# EAGLE design hundredsteppers (EAGLE 6.6.0)
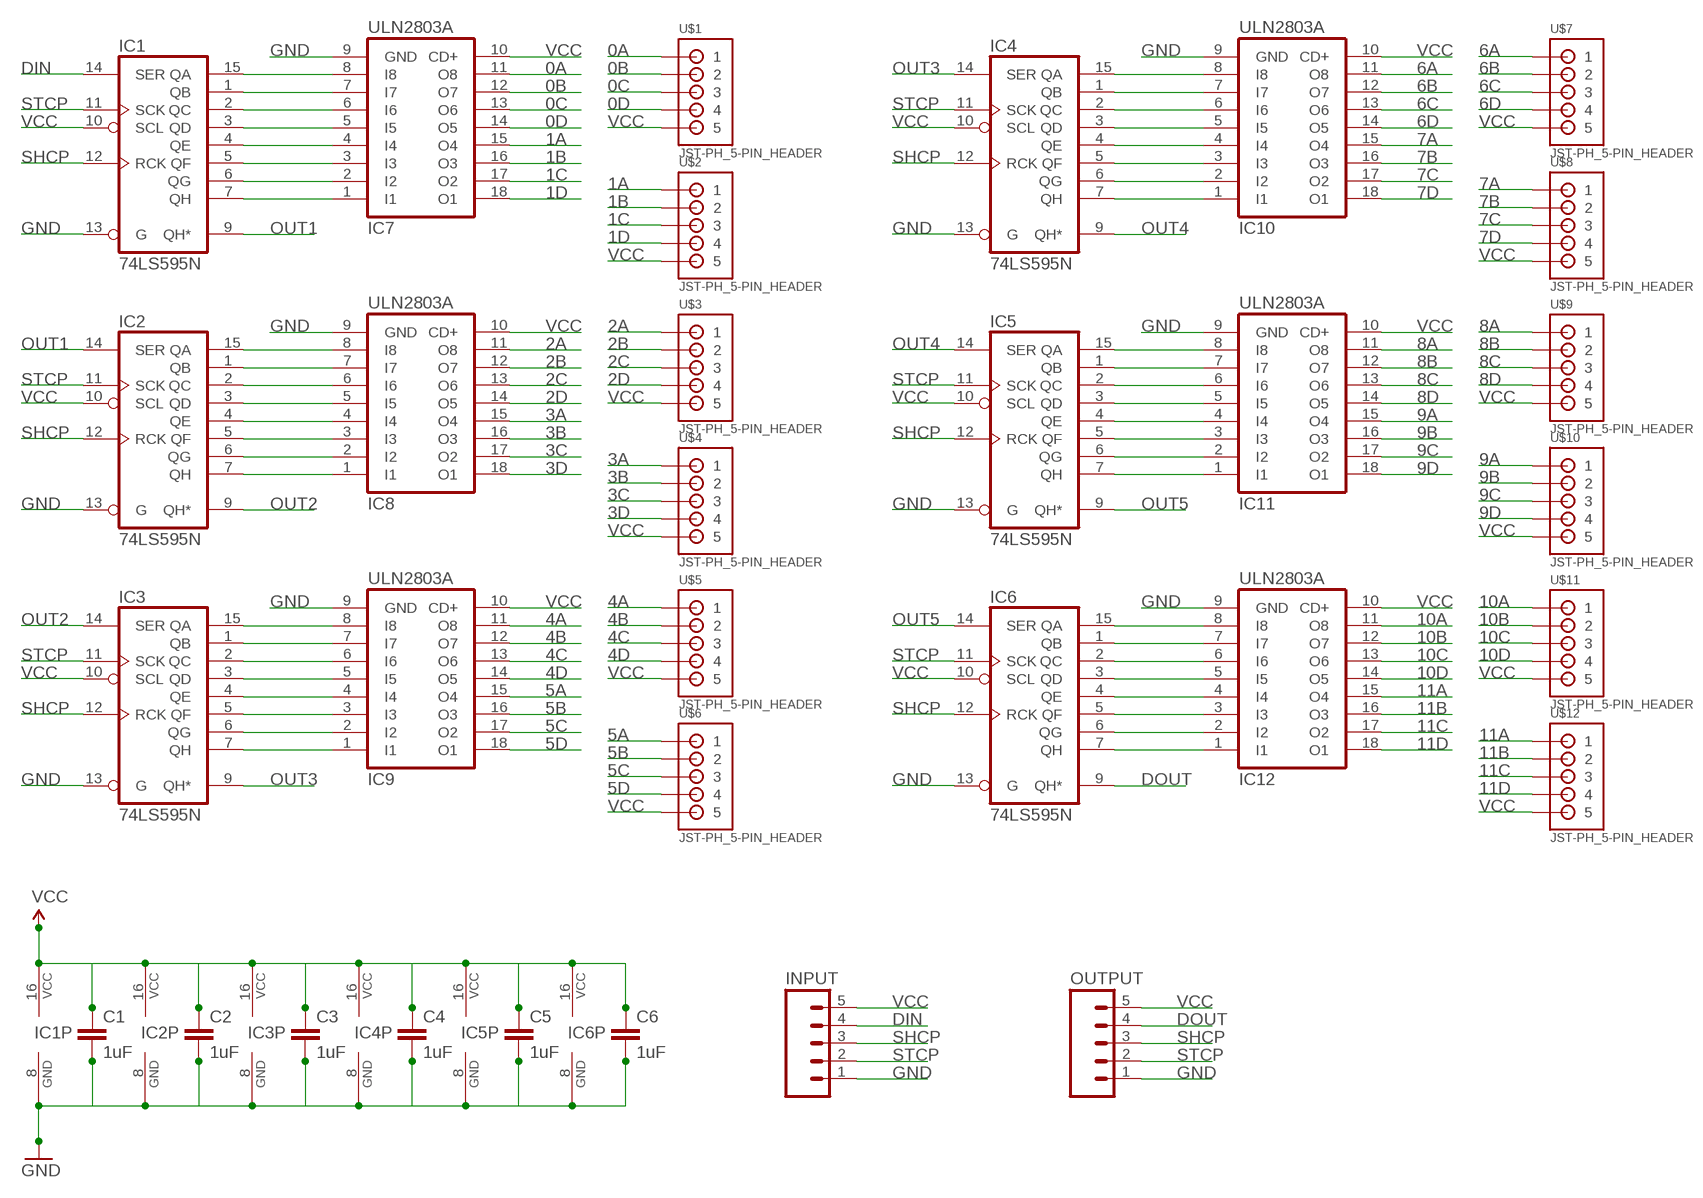
[diagram p0: schematic, sheet 1]

## Parts
C1  1uF  1UF-25V-10%(0805)  [0805]
C2  1uF  1UF-25V-10%(0805)  [0805]
C3  1uF  1UF-25V-10%(0805)  [0805]
C4  1uF  1UF-25V-10%(0805)  [0805]
C5  1uF  1UF-25V-10%(0805)  [0805]
C6  1uF  1UF-25V-10%(0805)  [0805]
IC1  74LS595N  [DIL16]
IC2  74LS595N  [DIL16]
IC3  74LS595N  [DIL16]
IC4  74LS595N  [DIL16]
IC5  74LS595N  [DIL16]
IC6  74LS595N  [DIL16]
IC7  ULN2803A  [DIL18]
IC8  ULN2803A  [DIL18]
IC9  ULN2803A  [DIL18]
IC10  ULN2803A  [DIL18]
IC11  ULN2803A  [DIL18]
IC12  ULN2803A  [DIL18]
INPUT  M05PTH  [1X05]
OUTPUT  M05PTH  [1X05]
U$1  JST-PH_5-PIN_HEADER  [JST_B5B-PH_HEADER]
U$2  JST-PH_5-PIN_HEADER  [JST_B5B-PH_HEADER]
U$3  JST-PH_5-PIN_HEADER  [JST_B5B-PH_HEADER]
U$4  JST-PH_5-PIN_HEADER  [JST_B5B-PH_HEADER]
U$5  JST-PH_5-PIN_HEADER  [JST_B5B-PH_HEADER]
U$6  JST-PH_5-PIN_HEADER  [JST_B5B-PH_HEADER]
U$7  JST-PH_5-PIN_HEADER  [JST_B5B-PH_HEADER]
U$8  JST-PH_5-PIN_HEADER  [JST_B5B-PH_HEADER]
U$9  JST-PH_5-PIN_HEADER  [JST_B5B-PH_HEADER]
U$10  JST-PH_5-PIN_HEADER  [JST_B5B-PH_HEADER]
U$11  JST-PH_5-PIN_HEADER  [JST_B5B-PH_HEADER]
U$12  JST-PH_5-PIN_HEADER  [JST_B5B-PH_HEADER]

## Nets
0A: IC7.11(O8) U$1.P1
0B: IC7.12(O7) U$1.P2
0C: IC7.13(O6) U$1.P3
0D: IC7.14(O5) U$1.P4
1A: IC7.15(O4) U$2.P1
1B: IC7.16(O3) U$2.P2
1C: IC7.17(O2) U$2.P3
1D: IC7.18(O1) U$2.P4
2A: IC8.11(O8) U$3.P1
2B: IC8.12(O7) U$3.P2
2C: IC8.13(O6) U$3.P3
2D: IC8.14(O5) U$3.P4
3A: IC8.15(O4) U$4.P1
3B: IC8.16(O3) U$4.P2
3C: IC8.17(O2) U$4.P3
3D: IC8.18(O1) U$4.P4
4A: IC9.11(O8) U$5.P1
4B: IC9.12(O7) U$5.P2
4C: IC9.13(O6) U$5.P3
4D: IC9.14(O5) U$5.P4
5A: IC9.15(O4) U$6.P1
5B: IC9.16(O3) U$6.P2
5C: IC9.17(O2) U$6.P3
5D: IC9.18(O1) U$6.P4
6A: IC10.11(O8) U$7.P1
6B: IC10.12(O7) U$7.P2
6C: IC10.13(O6) U$7.P3
6D: IC10.14(O5) U$7.P4
7A: IC10.15(O4) U$8.P1
7B: IC10.16(O3) U$8.P2
7C: IC10.17(O2) U$8.P3
7D: IC10.18(O1) U$8.P4
8A: IC11.11(O8) U$9.P1
8B: IC11.12(O7) U$9.P2
8C: IC11.13(O6) U$9.P3
8D: IC11.14(O5) U$9.P4
9A: IC11.15(O4) U$10.P1
9B: IC11.16(O3) U$10.P2
9C: IC11.17(O2) U$10.P3
9D: IC11.18(O1) U$10.P4
10A: IC12.11(O8) U$11.P1
10B: IC12.12(O7) U$11.P2
10C: IC12.13(O6) U$11.P3
10D: IC12.14(O5) U$11.P4
11A: IC12.15(O4) U$12.P1
11B: IC12.16(O3) U$12.P2
11C: IC12.17(O2) U$12.P3
11D: IC12.18(O1) U$12.P4
DIN: IC1.14(SER) INPUT.4
DOUT: IC6.9(QH*) OUTPUT.4
GND: C1.2 C2.2 C3.2 C4.2 C5.2 C6.2 IC1.8(GND) IC1.13(G) IC2.8(GND) IC2.13(G) IC3.8(GND) IC3.13(G) IC4.8(GND) IC4.13(G) IC5.8(GND) IC5.13(G) IC6.8(GND) IC6.13(G) IC7.9(GND) IC8.9(GND) IC9.9(GND) IC10.9(GND) IC11.9(GND) IC12.9(GND) INPUT.1 OUTPUT.1
N$1: IC1.15(QA) IC7.8(I8)
N$2: IC1.1(QB) IC7.7(I7)
N$3: IC1.2(QC) IC7.6(I6)
N$4: IC1.3(QD) IC7.5(I5)
N$5: IC1.4(QE) IC7.4(I4)
N$6: IC1.5(QF) IC7.3(I3)
N$7: IC1.6(QG) IC7.2(I2)
N$8: IC1.7(QH) IC7.1(I1)
N$9: IC2.15(QA) IC8.8(I8)
N$10: IC2.1(QB) IC8.7(I7)
N$11: IC2.2(QC) IC8.6(I6)
N$12: IC2.3(QD) IC8.5(I5)
N$13: IC2.4(QE) IC8.4(I4)
N$14: IC2.5(QF) IC8.3(I3)
N$15: IC2.6(QG) IC8.2(I2)
N$16: IC2.7(QH) IC8.1(I1)
N$17: IC3.15(QA) IC9.8(I8)
N$18: IC3.1(QB) IC9.7(I7)
N$19: IC3.2(QC) IC9.6(I6)
N$20: IC3.3(QD) IC9.5(I5)
N$21: IC3.4(QE) IC9.4(I4)
N$22: IC3.5(QF) IC9.3(I3)
N$23: IC3.6(QG) IC9.2(I2)
N$24: IC3.7(QH) IC9.1(I1)
N$25: IC4.15(QA) IC10.8(I8)
N$26: IC4.1(QB) IC10.7(I7)
N$27: IC4.2(QC) IC10.6(I6)
N$28: IC4.3(QD) IC10.5(I5)
N$29: IC4.4(QE) IC10.4(I4)
N$30: IC4.5(QF) IC10.3(I3)
N$31: IC4.6(QG) IC10.2(I2)
N$32: IC4.7(QH) IC10.1(I1)
N$33: IC5.15(QA) IC11.8(I8)
N$34: IC5.1(QB) IC11.7(I7)
N$35: IC5.2(QC) IC11.6(I6)
N$36: IC5.3(QD) IC11.5(I5)
N$37: IC5.4(QE) IC11.4(I4)
N$38: IC5.5(QF) IC11.3(I3)
N$39: IC5.6(QG) IC11.2(I2)
N$40: IC5.7(QH) IC11.1(I1)
N$41: IC6.15(QA) IC12.8(I8)
N$42: IC6.1(QB) IC12.7(I7)
N$43: IC6.2(QC) IC12.6(I6)
N$44: IC6.3(QD) IC12.5(I5)
N$45: IC6.4(QE) IC12.4(I4)
N$46: IC6.5(QF) IC12.3(I3)
N$47: IC6.6(QG) IC12.2(I2)
N$48: IC6.7(QH) IC12.1(I1)
OUT1: IC1.9(QH*) IC2.14(SER)
OUT2: IC2.9(QH*) IC3.14(SER)
OUT3: IC3.9(QH*) IC4.14(SER)
OUT4: IC4.9(QH*) IC5.14(SER)
OUT5: IC5.9(QH*) IC6.14(SER)
SHCP: IC1.12(RCK) IC2.12(RCK) IC3.12(RCK) IC4.12(RCK) IC5.12(RCK) IC6.12(RCK) INPUT.3 OUTPUT.3
STCP: IC1.11(SCK) IC2.11(SCK) IC3.11(SCK) IC4.11(SCK) IC5.11(SCK) IC6.11(SCK) INPUT.2 OUTPUT.2
VCC: C1.1 C2.1 C3.1 C4.1 C5.1 C6.1 IC1.10(SCL) IC1.16(VCC) IC2.10(SCL) IC2.16(VCC) IC3.10(SCL) IC3.16(VCC) IC4.10(SCL) IC4.16(VCC) IC5.10(SCL) IC5.16(VCC) IC6.10(SCL) IC6.16(VCC) IC7.10(CD+) IC8.10(CD+) IC9.10(CD+) IC10.10(CD+) IC11.10(CD+) IC12.10(CD+) INPUT.5 OUTPUT.5 U$1.P5 U$2.P5 U$3.P5 U$4.P5 U$5.P5 U$6.P5 U$7.P5 U$8.P5 U$9.P5 U$10.P5 U$11.P5 U$12.P5

## Library data of the parts
C1-C6 = SparkFun-Capacitors:1UF-25V-10%(0805): CAP-08064; PROD_ID: CAP-08064
IC1-IC6 = 74xx-us:74*595: 8-bit SHIFT REGISTER, output latch
IC7-IC12 = uln-udn:ULN2803A: DRIVER ARRAY
INPUT OUTPUT = SparkFun-Connectors:M05: Header 5 Standard 5-pin 0.1" header. Use with straight break away headers (SKU : PRT-00116), right angle break away headers (PRT-00553), swiss pins (PRT-00743), machine pins (PRT-00117), and female headers (PRT-00115). Molex polarized connector foot print use with SKU : PRT-08230 with associated crimp pins and housings.
U$1-U$12 = SRG:JST-PH_5-PIN_HEADER: 5-pin JST PH Shrouded Header, top entry P/N B5B-PH-K-S Mating connector PHR-5 Mating cable assembly: Sparkfun PRT-09917 <http://www.sparkfun.com/products/9917>

## Board
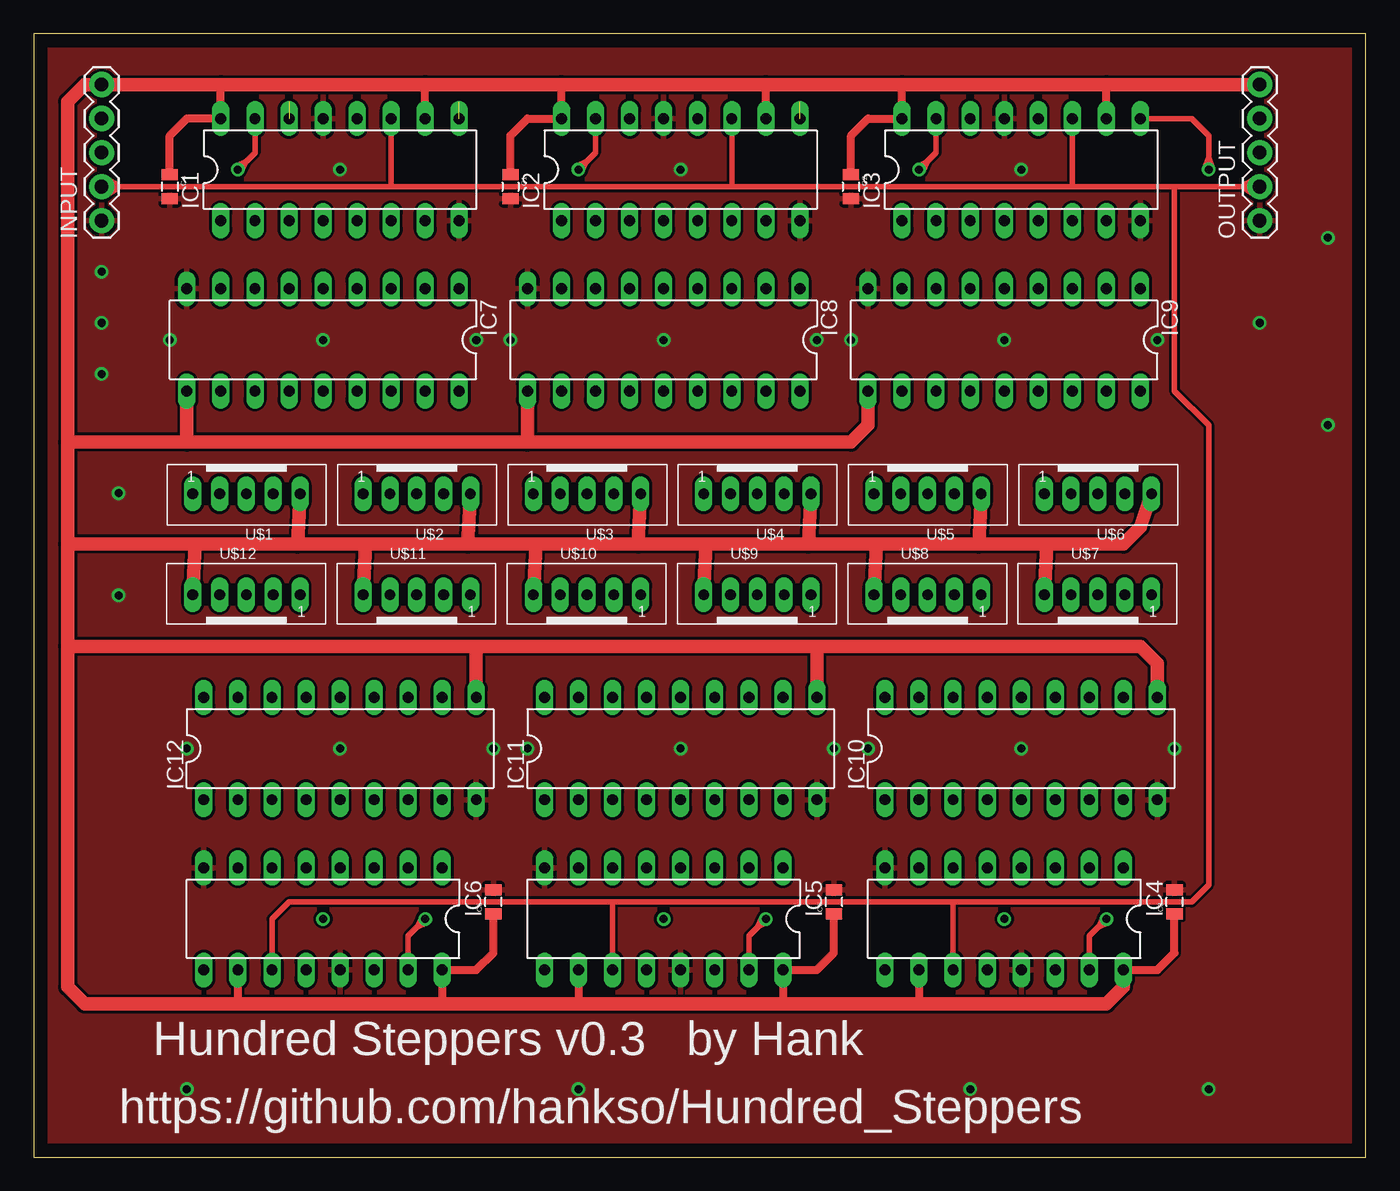
[diagram p1: board, top side]
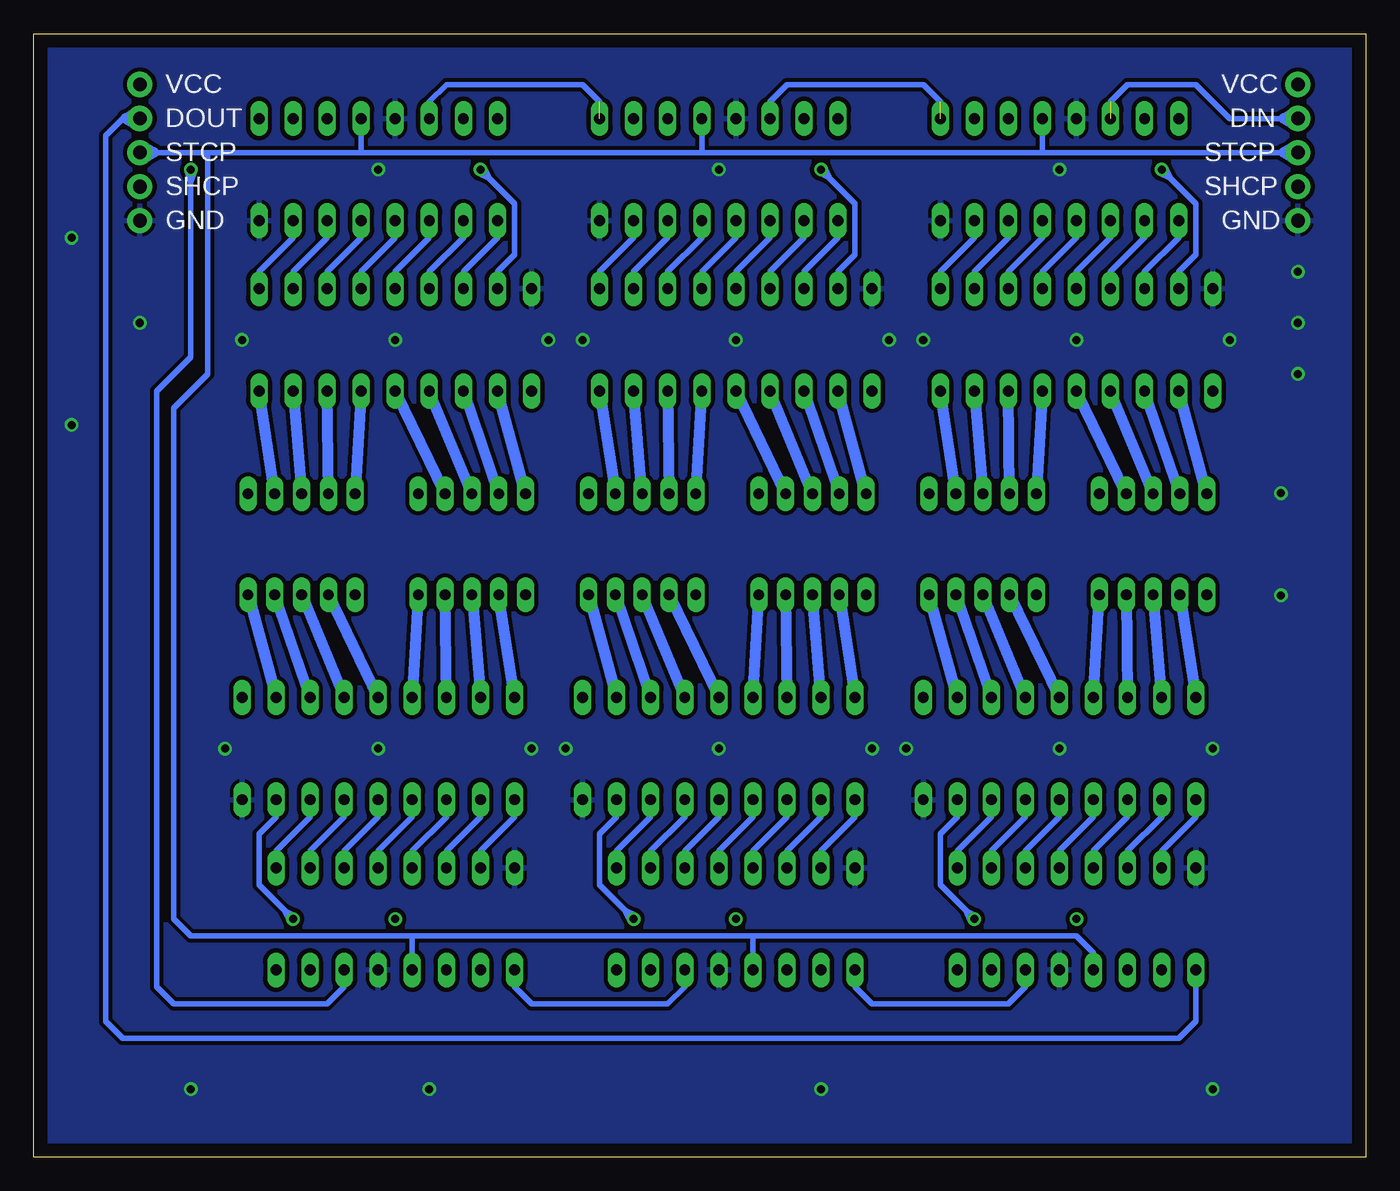
[diagram p2: board, bottom side, seen from below]

Size 99.36 x 83.81 mm. Coordinates in mm from the lower left corner, seen from the top.
Outline: 0,0 99.36,0 99.36,83.81 0,83.81 0,0
Copper layers (1*16): Top 0.035mm / dielectric 1.5mm / Bottom 0.035mm
Design rules "default *": minimum track width 10mil, minimum drill 24mil, track to track 8mil, track to pad 8mil, pad to pad 8mil, via to via 8mil, smd to smd 8mil, copper to edge 40mil, drill to drill 8mil, minimum pad ring 10mil, minimum via ring 8mil, stop-mask expansion 4mil, vias tented up to drill 24mil, thermal gap 10mil

### Footprints (pad centres in the part's own frame; a part is rotated, then mirrored left to right if it is on the bottom)
0805 = smd 0.8 x 1.2: 1 -0.9,0; 2 0.9,0
DIL16 = drill 0.813 long: 1 -8.89,-3.81; 2 -6.35,-3.81; 3 -3.81,-3.81; 4 -1.27,-3.81; 5 1.27,-3.81; 6 3.81,-3.81; 7 6.35,-3.81; 8 8.89,-3.81; 9 8.89,3.81; 10 6.35,3.81; 11 3.81,3.81; 12 1.27,3.81; 13 -1.27,3.81; 14 -3.81,3.81; 15 -6.35,3.81; 16 -8.89,3.81
DIL18 = drill 0.813 long: 1 -10.16,-3.81; 2 -7.62,-3.81; 3 -5.08,-3.81; 4 -2.54,-3.81; 5 0,-3.81; 6 2.54,-3.81; 7 5.08,-3.81; 8 7.62,-3.81; 9 10.16,-3.81; 10 10.16,3.81; 11 7.62,3.81; 12 5.08,3.81; 13 2.54,3.81; 14 0,3.81; 15 -2.54,3.81; 16 -5.08,3.81; 17 -7.62,3.81; 18 -10.16,3.81
1X05 = drill 1.016 pad 1.88: 1 0,0; 2 2.54,0; 3 5.08,0; 4 7.62,0; 5 10.16,0
JST_B5B-PH_HEADER = drill 0.8 long: P1 4,0.048; P2 2,0.048; P3 0,0.048; P4 -2,0.048; P5 -4,0.048

### Placement (x,y rotation side)
C1  35.56,72.39 270 top
C2  60.96,72.39 270 top
C3  85.09,19.05 90 top
C4  10.16,72.39 270 top
C5  34.29,19.05 90 top
C6  59.69,19.05 90 top
IC1  22.86,73.66 0 top
IC2  48.26,73.66 0 top
IC3  73.66,73.66 0 top
IC4  72.39,17.78 180 top
IC5  46.99,17.78 180 top
IC6  21.59,17.78 180 top
IC7  21.59,60.96 180 top
IC8  46.99,60.96 180 top
IC9  72.39,60.96 180 top
IC10  73.66,30.48 0 top
IC11  48.26,30.48 0 top
IC12  22.86,30.48 0 top
INPUT  5.08,69.85 90 top
OUTPUT  91.44,69.85 90 top
U$1  15.88,49.53 180 top
U$2  28.57,49.53 180 top
U$3  41.27,49.53 180 top
U$4  53.98,49.53 180 top
U$5  66.67,49.53 180 top
U$6  79.38,49.53 180 top
U$7  79.38,41.91 0 top
U$8  66.67,41.91 0 top
U$9  53.98,41.91 0 top
U$10  41.27,41.91 0 top
U$11  28.57,41.91 0 top
U$12  15.88,41.91 0 top

### Tracks (layer width: path | path; a pad name or v marks a point on that pad's centre or on a via)
0A
  Bottom 0.813: U$1.P1 IC7.11
0B
  Bottom 0.813: U$1.P2 IC7.12
0C
  Bottom 0.813: U$1.P3 IC7.13
0D
  Bottom 0.813: U$1.P4 IC7.14
1A
  Bottom 0.813: IC7.15 U$2.P1
1B
  Bottom 0.813: U$2.P2 IC7.16
1C
  Bottom 0.813: IC7.17 U$2.P3
1D
  Bottom 0.813: U$2.P4 IC7.18
2A
  Bottom 0.813: U$3.P1 IC8.11
2B
  Bottom 0.813: IC8.12 U$3.P2
2C
  Bottom 0.813: U$3.P3 IC8.13
2D
  Bottom 0.813: IC8.14 U$3.P4
3A
  Bottom 0.813: U$4.P1 IC8.15
3B
  Bottom 0.813: IC8.16 U$4.P2
3C
  Bottom 0.813: U$4.P3 IC8.17
3D
  Bottom 0.813: IC8.18 U$4.P4
4A
  Bottom 0.813: U$5.P1 IC9.11
4B
  Bottom 0.813: IC9.12 U$5.P2
4C
  Bottom 0.813: U$5.P3 IC9.13
4D
  Bottom 0.813: IC9.14 U$5.P4
5A
  Bottom 0.813: IC9.15 U$6.P1
5B
  Bottom 0.813: U$6.P2 IC9.16
5C
  Bottom 0.813: IC9.17 U$6.P3
5D
  Bottom 0.813: U$6.P4 IC9.18
6A
  Bottom 0.813: U$7.P1 IC10.11
6B
  Bottom 0.813: IC10.12 U$7.P2
6C
  Bottom 0.813: U$7.P3 IC10.13
6D
  Bottom 0.813: IC10.14 U$7.P4
7A
  Bottom 0.813: U$8.P1 IC10.15
7B
  Bottom 0.813: IC10.16 U$8.P2
7C
  Bottom 0.813: U$8.P3 IC10.17
7D
  Bottom 0.813: IC10.18 U$8.P4
8A
  Bottom 0.813: U$9.P1 IC11.11
8B
  Bottom 0.813: U$9.P2 IC11.12
8C
  Bottom 0.813: IC11.13 U$9.P3
8D
  Bottom 0.813: U$9.P4 IC11.14
9A
  Bottom 0.813: IC11.15 U$10.P1
9B
  Bottom 0.813: U$10.P2 IC11.16
9C
  Bottom 0.813: IC11.17 U$10.P3
9D
  Bottom 0.813: U$10.P4 IC11.18
10A
  Bottom 0.813: IC12.11 U$11.P1
10B
  Bottom 0.813: U$11.P2 IC12.12
10C
  Bottom 0.813: IC12.13 U$11.P3
10D
  Bottom 0.813: U$11.P4 IC12.14
11A
  Bottom 0.813: IC12.15 U$12.P1
11B
  Bottom 0.813: U$12.P2 IC12.16
11C
  Bottom 0.813: IC12.17 U$12.P3
11D
  Bottom 0.813: U$12.P4 IC12.18
DIN  (1 unrouted)
  Bottom 0.406: 19.05,78.74 17.78,80.01 12.7,80.01 10.16,77.47 6.1,77.47 INPUT.4
  Bottom 0.813: 6.1,77.47 5.36,77.92 INPUT.4 5.36,77.02 6.1,77.47
DOUT
  Bottom 0.406: IC6.9 12.7,10.16 13.97,8.89 92.71,8.89 93.98,10.16 93.98,76.2 92.71,77.47 92.46,77.47 OUTPUT.4
  Bottom 0.813: 92.46,77.47 91.72,77.92 OUTPUT.4 91.72,77.02 92.46,77.47
GND  (via drill 0.6)
  other vias: 5.08,66.04 5.08,62.23 10.16,60.96 5.08,58.42 21.59,60.96 35.56,60.96 33.02,60.96 22.86,73.66 46.99,60.96 58.42,60.96 60.96,60.96 83.82,60.96 91.44,62.23 96.52,54.61 96.52,68.58 72.39,60.96 73.66,73.66 48.26,73.66 87.63,5.08 69.85,5.08 40.64,5.08 11.43,5.08 6.35,49.53 6.35,41.91 11.43,30.48 34.29,30.48 36.83,30.48 59.69,30.48 62.23,30.48 85.09,30.48 22.86,30.48 48.26,30.48 73.66,30.48
  pour Bottom (isolate 0.305): 0,0 0,83.82 99.06,83.82 99.06,0
  pour Top: 0,83.82 0,0 99.06,0 99.06,83.82
N$1  (via drill 0.6)
  Top 0.406: IC1.15 16.51,74.93 15.88,74.3 | 15.88,74.3 v15.24,73.66 | 15.88,74.3 15.11,73.93 v15.24,73.66 | 15.88,74.3 15.51,73.53 v15.24,73.66
  Bottom 0.406: v15.24,73.66 14.6,73.02 | 14.6,73.02 12.7,71.12 12.7,67.31 13.97,66.04 IC7.8 | 14.6,73.02 15.37,73.39 v15.24,73.66 | 14.6,73.02 14.97,73.79 v15.24,73.66
N$2
  Bottom 0.406: IC1.1 13.97,68.58 16.51,66.04 IC7.7
N$3
  Bottom 0.406: IC1.2 16.51,68.58 19.05,66.04 IC7.6
N$4
  Bottom 0.406: IC1.3 19.05,68.58 21.59,66.04 IC7.5
N$5
  Bottom 0.406: IC1.4 21.59,68.58 24.13,66.04 IC7.4
N$6
  Bottom 0.406: IC1.5 24.13,68.58 26.67,66.04 IC7.3
N$7
  Bottom 0.406: IC1.6 26.67,68.58 29.21,66.04 IC7.2
N$8
  Bottom 0.406: IC1.7 29.21,68.58 31.75,66.04 IC7.1
N$9  (via drill 0.6)
  Top 0.406: IC2.15 41.91,74.93 41.28,74.3 | 41.28,74.3 v40.64,73.66 | 41.28,74.3 40.51,73.93 v40.64,73.66 | 41.28,74.3 40.91,73.53 v40.64,73.66
  Bottom 0.406: v40.64,73.66 40,73.02 | 40,73.02 38.1,71.12 38.1,67.31 39.37,66.04 IC8.8 | 40,73.02 40.77,73.39 v40.64,73.66 | 40,73.02 40.37,73.79 v40.64,73.66
N$10
  Bottom 0.406: IC2.1 39.37,68.58 41.91,66.04 IC8.7
N$11
  Bottom 0.406: IC2.2 41.91,68.58 44.45,66.04 IC8.6
N$12
  Bottom 0.406: IC2.3 44.45,68.58 46.99,66.04 IC8.5
N$13
  Bottom 0.406: IC2.4 46.99,68.58 49.53,66.04 IC8.4
N$14
  Bottom 0.406: IC2.5 49.53,68.58 52.07,66.04 IC8.3
N$15
  Bottom 0.406: IC2.6 52.07,68.58 54.61,66.04 IC8.2
N$16
  Bottom 0.406: IC2.7 54.61,68.58 57.15,66.04 IC8.1
N$17  (via drill 0.6)
  Top 0.406: IC3.15 67.31,74.93 66.68,74.3 | 66.68,74.3 v66.04,73.66 | 66.68,74.3 65.91,73.93 v66.04,73.66 | 66.68,74.3 66.31,73.53 v66.04,73.66
  Bottom 0.406: v66.04,73.66 65.4,73.02 | 65.4,73.02 63.5,71.12 63.5,67.31 64.77,66.04 IC9.8 | 65.4,73.02 66.17,73.39 v66.04,73.66 | 65.4,73.02 65.77,73.79 v66.04,73.66
N$18
  Bottom 0.406: IC3.1 64.77,68.58 67.31,66.04 IC9.7
N$19
  Bottom 0.406: IC3.2 67.31,68.58 69.85,66.04 IC9.6
N$20
  Bottom 0.406: IC3.3 69.85,68.58 72.39,66.04 IC9.5
N$21
  Bottom 0.406: IC3.4 72.39,68.58 74.93,66.04 IC9.4
N$22
  Bottom 0.406: IC3.5 74.93,68.58 77.47,66.04 IC9.3
N$23
  Bottom 0.406: IC3.6 77.47,68.58 80.01,66.04 IC9.2
N$24
  Bottom 0.406: IC3.7 80.01,68.58 82.55,66.04 IC9.1
N$25  (via drill 0.6)
  Top 0.406: IC4.15 78.74,16.51 79.37,17.14 | 79.37,17.14 v80.01,17.78 | 79.37,17.14 80.14,17.51 v80.01,17.78 | 79.37,17.14 79.74,17.91 v80.01,17.78
  Bottom 0.406: v80.01,17.78 80.65,18.42 | 80.65,18.42 82.55,20.32 82.55,24.13 81.28,25.4 IC10.8 | 80.65,18.42 79.88,18.05 v80.01,17.78 | 80.65,18.42 80.28,17.65 v80.01,17.78
N$26
  Bottom 0.406: IC10.7 78.74,25.4 81.28,22.86 IC4.1
N$27
  Bottom 0.406: IC4.2 78.74,22.86 76.2,25.4 IC10.6
N$28
  Bottom 0.406: IC10.5 73.66,25.4 76.2,22.86 IC4.3
N$29
  Bottom 0.406: IC4.4 73.66,22.86 71.12,25.4 IC10.4
N$30
  Bottom 0.406: IC4.5 71.12,22.86 68.58,25.4 IC10.3
N$31
  Bottom 0.406: IC10.2 66.04,25.4 68.58,22.86 IC4.6
N$32
  Bottom 0.406: IC4.7 66.04,22.86 63.5,25.4 IC10.1
N$33  (via drill 0.6)
  Top 0.406: IC5.15 53.34,16.51 53.97,17.14 | 53.97,17.14 v54.61,17.78 | 53.97,17.14 54.74,17.51 v54.61,17.78 | 53.97,17.14 54.34,17.91 v54.61,17.78
  Bottom 0.406: v54.61,17.78 55.25,18.42 | 55.25,18.42 57.15,20.32 57.15,24.13 55.88,25.4 IC11.8 | 55.25,18.42 54.48,18.05 v54.61,17.78 | 55.25,18.42 54.88,17.65 v54.61,17.78
N$34
  Bottom 0.406: IC11.7 53.34,25.4 55.88,22.86 IC5.1
N$35
  Bottom 0.406: IC11.6 50.8,25.4 53.34,22.86 IC5.2
N$36
  Bottom 0.406: IC11.5 48.26,25.4 50.8,22.86 IC5.3
N$37
  Bottom 0.406: IC11.4 45.72,25.4 48.26,22.86 IC5.4
N$38
  Bottom 0.406: IC11.3 43.18,25.4 45.72,22.86 IC5.5
N$39
  Bottom 0.406: IC11.2 40.64,25.4 43.18,22.86 IC5.6
N$40
  Bottom 0.406: IC11.1 38.1,25.4 40.64,22.86 IC5.7
N$41  (via drill 0.6)
  Top 0.406: v29.21,17.78 28.57,17.14 | 28.57,17.14 27.94,16.51 IC6.15 | 28.57,17.14 29.34,17.51 v29.21,17.78 | 28.57,17.14 28.94,17.91 v29.21,17.78
  Bottom 0.406: IC12.8 30.48,25.4 31.75,24.13 31.75,20.32 29.85,18.42 | 29.85,18.42 v29.21,17.78 | 29.85,18.42 29.08,18.05 v29.21,17.78 | 29.85,18.42 29.48,17.65 v29.21,17.78
N$42
  Bottom 0.406: IC12.7 27.94,25.4 30.48,22.86 IC6.1
N$43
  Bottom 0.406: IC12.6 25.4,25.4 27.94,22.86 IC6.2
N$44
  Bottom 0.406: IC12.5 22.86,25.4 25.4,22.86 IC6.3
N$45
  Bottom 0.406: IC12.4 20.32,25.4 22.86,22.86 IC6.4
N$46
  Bottom 0.406: IC12.3 17.78,25.4 20.32,22.86 IC6.5
N$47
  Bottom 0.406: IC12.2 15.24,25.4 17.78,22.86 IC6.6
N$48
  Bottom 0.406: IC12.1 12.7,25.4 15.24,22.86 IC6.7
N$78  (via drill 0.6)
  other vias: 46.99,17.78
N$79  (via drill 0.6)
  other vias: 72.39,17.78
N$80  (via drill 0.6)
  other vias: 21.59,17.78
OUT1  (1 unrouted)
  Bottom 0.406: IC2.14 44.45,78.74 43.18,80.01 33.02,80.01 31.75,78.74
OUT2  (1 unrouted)
  Bottom 0.406: 57.15,78.74 58.42,80.01 68.58,80.01 69.85,78.74 IC3.14
OUT3  (via drill 0.6)
  Top 0.406: IC3.9 86.36,77.47 87.63,76.2 87.63,74.56 | 87.63,74.56 v87.63,73.66 | 87.63,74.56 87.35,73.76 v87.63,73.66 | 87.63,74.56 87.91,73.76 v87.63,73.66
  Bottom 0.406: v87.63,73.66 87.63,72.76 | 87.63,72.76 87.63,59.69 90.17,57.15 90.17,12.7 88.9,11.43 77.47,11.43 76.2,12.7 IC4.14 | 87.63,72.76 87.91,73.56 v87.63,73.66 | 87.63,72.76 87.35,73.56 v87.63,73.66
OUT4
  Bottom 0.406: IC4.9 63.5,12.7 62.23,11.43 52.07,11.43 50.8,12.7 IC5.14
OUT5
  Bottom 0.406: IC5.9 38.1,12.7 36.83,11.43 26.67,11.43 25.4,12.7 IC6.14
SHCP
  Bottom 0.406: INPUT.3 6.1,74.93 24.13,74.93 | IC1.12 24.13,74.93 | 24.13,74.93 49.53,74.93 | 49.53,74.93 74.93,74.93 | 74.93,74.93 86.36,74.93 | 86.36,74.93 90.42,74.93 OUTPUT.3 | IC3.12 74.93,74.93 | IC2.12 49.53,74.93 | 71.12,16.51 87.63,16.51 88.9,17.78 88.9,55.88 86.36,58.42 86.36,74.93 | 71.12,16.51 45.72,16.51 | 45.72,16.51 21.59,16.51 20.32,15.24 IC6.12 | IC5.12 45.72,16.51 | IC4.12 71.12,16.51
  Bottom 0.813: 90.42,74.93 91.16,74.48 OUTPUT.3 91.16,75.38 90.42,74.93 | 6.1,74.93 5.36,75.38 INPUT.3 5.36,74.48 6.1,74.93
STCP
  Top 0.406: INPUT.2 6.1,72.39 26.67,72.39 | 26.67,72.39 52.07,72.39 | 52.07,72.39 77.47,72.39 | 77.47,72.39 85.09,72.39 | IC1.11 26.67,72.39 | IC2.11 52.07,72.39 | IC3.11 77.47,72.39 | 85.09,72.39 85.09,57.15 87.63,54.61 87.63,20.32 86.36,19.05 68.58,19.05 | 68.58,19.05 43.18,19.05 | 43.18,19.05 19.05,19.05 17.78,17.78 IC6.11 | IC5.11 43.18,19.05 | IC4.11 68.58,19.05 | OUTPUT.2 90.42,72.39 85.09,72.39
  Top 0.813: 90.42,72.39 91.16,71.94 OUTPUT.2 91.16,72.84 90.42,72.39 | 6.1,72.39 5.36,72.84 INPUT.2 5.36,71.94 6.1,72.39
VCC
  Top 0.61: IC3.10 80.01,80.01 | C4.1 10.16,76.2 11.43,77.47 IC1.16 13.97,80.01 | C1.1 35.56,76.2 36.83,77.47 IC2.16 39.37,80.01 | C2.1 60.96,76.2 62.23,77.47 IC3.16 64.77,80.01 | IC4.10 66.04,11.43 | 55.88,11.43 IC5.16 58.42,13.97 59.69,15.24 C6.1 | IC5.10 40.64,11.43 | 30.48,11.43 IC6.16 33.02,13.97 34.29,15.24 C5.1 | IC6.10 15.24,11.43 | IC4.16 83.82,13.97 85.09,15.24 C3.1 | IC1.10 29.21,80.01 | IC2.10 54.61,80.01
  Top 1.016: OUTPUT.5 80.01,80.01 64.77,80.01 54.61,80.01 39.37,80.01 29.21,80.01 13.97,80.01 INPUT.5 3.81,80.01 2.54,78.74 2.54,53.34 | 2.54,53.34 2.54,45.72 | 2.54,45.72 2.54,38.1 | 2.54,38.1 2.54,12.7 3.81,11.43 15.24,11.43 30.48,11.43 40.64,11.43 55.88,11.43 66.04,11.43 80.01,11.43 81.28,12.7 IC4.16 | IC9.10 62.23,54.61 60.96,53.34 36.83,53.34 | 36.83,53.34 11.43,53.34 | 11.43,53.34 2.54,53.34 | IC10.10 83.82,36.83 82.55,38.1 58.42,38.1 | 58.42,38.1 33.02,38.1 | 33.02,38.1 2.54,38.1 | IC7.10 11.43,53.34 | IC8.10 36.83,53.34 | IC11.10 58.42,38.1 | IC12.10 33.02,38.1 | U$6.P5 82.55,46.99 81.28,45.72 75.56,45.72 | 75.56,45.72 70.48,45.72 | 70.48,45.72 62.87,45.72 | 62.87,45.72 57.78,45.72 | 57.78,45.72 50.16,45.72 | 50.16,45.72 45.09,45.72 | 45.09,45.72 37.47,45.72 | 37.47,45.72 32.38,45.72 | 32.38,45.72 24.77,45.72 | 24.77,45.72 19.68,45.72 | 19.68,45.72 12.06,45.72 | 12.06,45.72 2.54,45.72 | U$12.P5 12.06,45.72 | U$1.P5 19.68,45.72 | U$11.P5 24.77,45.72 | U$10.P5 37.47,45.72 | U$2.P5 32.38,45.72 | U$7.P5 75.56,45.72 | U$8.P5 62.87,45.72 | U$9.P5 50.16,45.72 | U$3.P5 45.09,45.72 | U$4.P5 57.78,45.72 | U$5.P5 70.48,45.72

### Text on the board
tPlace: Hundred Steppers v0.3 by Hank | https://github.com/hankso/Hundred_Steppers
bPlace: VCC | VCC | DIN | DOUT | STCP | STCP | SHCP | SHCP | GND | GND